# Altium schematic sheet SH8 - CAN.SchDoc: CAN
size B; Engineer: Farris Matar; Organization: UW Robotics; Address1: 200 University Avenue; Address2: Waterloo; Address3: Ontario; Address4: Canada N2L 3G6; DocumentNumber: 8; Revision: 3; SheetNumber: 8; SheetTotal: 9
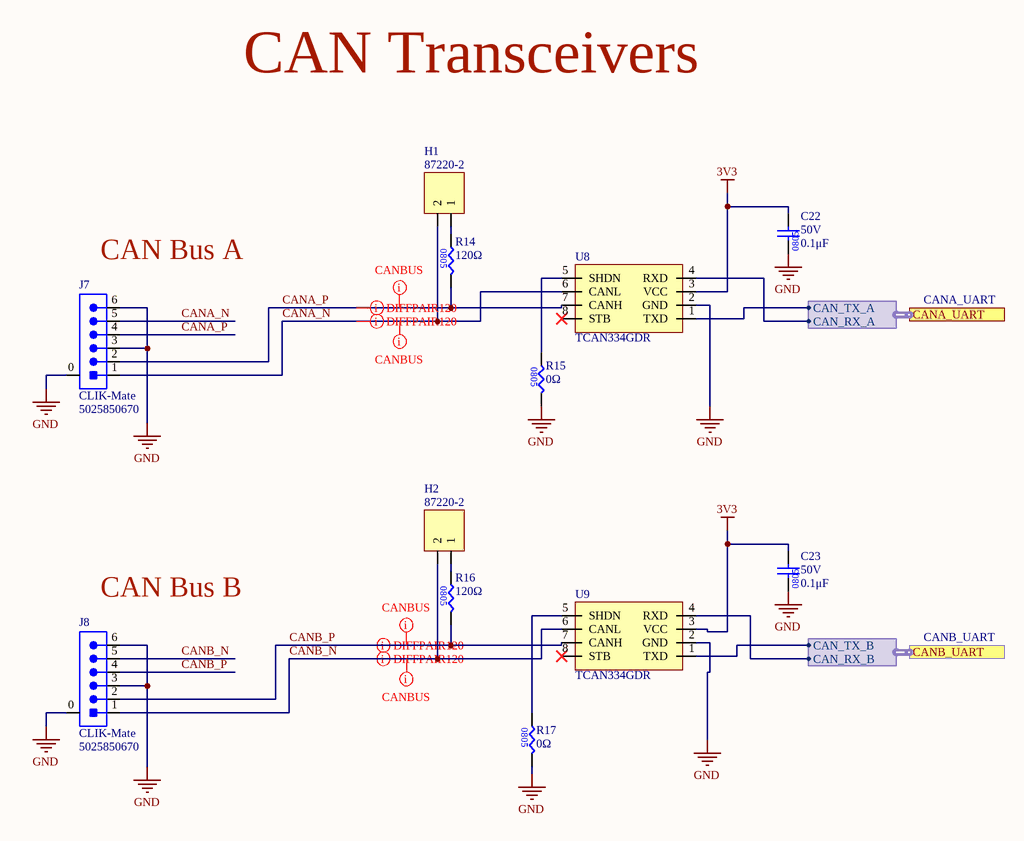
[diagram p0: SH8 - CAN.SchDoc]

## Parts
C22  value 0.1μF  Voltage Rating: 50V  [CAP2012]  (hidden comment: CAP_0.1uF_50V_0805)
C23  value 0.1μF  Voltage Rating: 50V  [CAP2012]  (hidden comment: CAP_0.1uF_50V_0805)
H1  Manufacturer Part Number 1: 87220-2  [HDR1X2]  (hidden comment: JUMPER_2)
H2  Manufacturer Part Number 1: 87220-2  [HDR1X2]  (hidden comment: JUMPER_2)
J7  Family: CLIK-Mate  Manufacturer Part Number 1: 5025850670  [MOLEX-5025850670]  (hidden comment: CON_6M_SM_RA_1.5mm)
J8  Family: CLIK-Mate  Manufacturer Part Number 1: 5025850670  [MOLEX-5025850670]  (hidden comment: CON_6M_SM_RA_1.5mm)
R14  value 120Ω  [RES0805]  (hidden comment: RES_120Ω_0805_1%)
R15  value 0Ω  [RES0805]  (hidden comment: RES_0Ω_0805)
R16  value 120Ω  [RES0805]  (hidden comment: RES_120Ω_0805_1%)
R17  value 0Ω  [RES0805]  (hidden comment: RES_0Ω_0805)
U8  Manufacturer Part Number 1: TCAN334GDR  [SOIC127P600X175-8N]  (hidden comment: IC_CAN_TRANSCEIVER)
U9  Manufacturer Part Number 1: TCAN334GDR  [SOIC127P600X175-8N]  (hidden comment: IC_CAN_TRANSCEIVER)

## Ports
CANA_UART (harness CANA_UART), CANB_UART (harness CANB_UART)

## Harnesses
CANA_UART: CAN_RX_A, CAN_TX_A
CANB_UART: CAN_RX_B, CAN_TX_B

## Nets
3V3: C22.2 C23.2 U8.3(VCC) U9.3(VCC)
GND: C22.1 C23.1 J7.0 J7.3 J7.6 J8.0 J8.3 J8.6 R15.2 R17.2 U8.2(GND) U9.2(GND)
CANA_N: H1.2 J7.1 J7.5 U8.6(CANL)
CANA_P: J7.2 J7.4 R14.2 U8.7(CANH)
CANB_N: H2.2 J8.1 J8.5 U9.6(CANL)
CANB_P: J8.2 J8.4 R16.2 U9.7(CANH)
NetH1_1: H1.1 R14.1
NetH2_1: H2.1 R16.1
NetR15_1: R15.1 U8.5(SHDN)
NetR17_1: R17.1 U9.5(SHDN)
NetU8_1: U8.1(TXD) ; port CANA_UART.CAN_TX_A
NetU8_4: U8.4(RXD) ; port CANA_UART.CAN_RX_A
NetU9_1: U9.1(TXD) ; port CANB_UART.CAN_TX_B
NetU9_4: U9.4(RXD) ; port CANB_UART.CAN_RX_B

Not connected (* = marked no-connect by the designer): U8 8(STB)*; U9 8(STB)*

## Layout directives
differential pair; differential pair class CANBUS120: CANA_N, CANA_P, CANB_N, CANB_P
mark named CANBUS: CANA_N, CANA_P, CANB_N, CANB_P

## Notes on the sheet
- CAN Transceivers
- (near J7) CAN Bus A
- (near J8) CAN Bus B
- Title:
- Project:
- Date:
- Rev:
- Reviewer:
- Engineer:
- Sheet:
- of

## Library data of the parts
C22 C23 = CAP_0.1uF_50V_0805: CAP CER 0.1UF 50V X7R 0805; Manufacturer Part Number 1: GCM21BR71H104KA37K; Manufacturer 1: Murata Electronics; Package/Footprint: 0805; Supplier Part Number 1: 490-8049-1-ND; Supplier 1: Digi-Key; Dielectric: X7R; LCSC Part #: C49678; Mounting Type: SMD
H1 H2 = JUMPER_2: HEADER 2X1; Manufacturer 1: TE Connectivity; Package/Footprint: TH; Supplier 1: Digi-Key; Supplier Part Number 1: A26542-ND; Mount: Through Hole; Mounting Type: TH
J7 J8 = CON_6M_SM_RA_1.5mm: CONN HEADER SMD RIGHT ANGLE 1.5 MM PITCH; Manufacturer 1: Molex; Supplier 1: Digi-Key; Supplier Part Number 1: WM12832CT-ND; Package/Footprint: SMD; Mounting Type: SMD
R14 R16 = RES_120Ω_0805_1%: RES 120 OHM 1% 1/8W 0805; Manufacturer 1: Vishay; Manufacturer Part Number 1: CRCW0805120RFKEA; Package/Footprint: 0805; Supplier Part Number 1: 541-120CCT-ND; Supplier 1: Digi-Key; LCSC Part #: C17437; Mounting Type: SMD
R15 R17 = RES_0Ω_0805: RES 0 OHM JUMPER 1/8W 0805; Manufacturer 1: Panasonic Electronic Components; Manufacturer Part Number 1: ERJ-6GEY0R00V; Package/Footprint: 0805; Supplier Part Number 1: P0.0ACT-ND; Supplier 1: Digi-Key; LCSC Part #: C17477; Mounting Type: SMD
U8 U9 = IC_CAN_TRANSCEIVER: IC TRANSCEIVER 1/1 8SOIC; Manufacturer 1: Maxim; Package/Footprint: 14-SOIC; Mounting Type: SMD; Supplier 1: Digi-Key; Supplier Part Number 1: 296-49940-1-ND